# EAGLE design AKS (EAGLE 7.7.0)
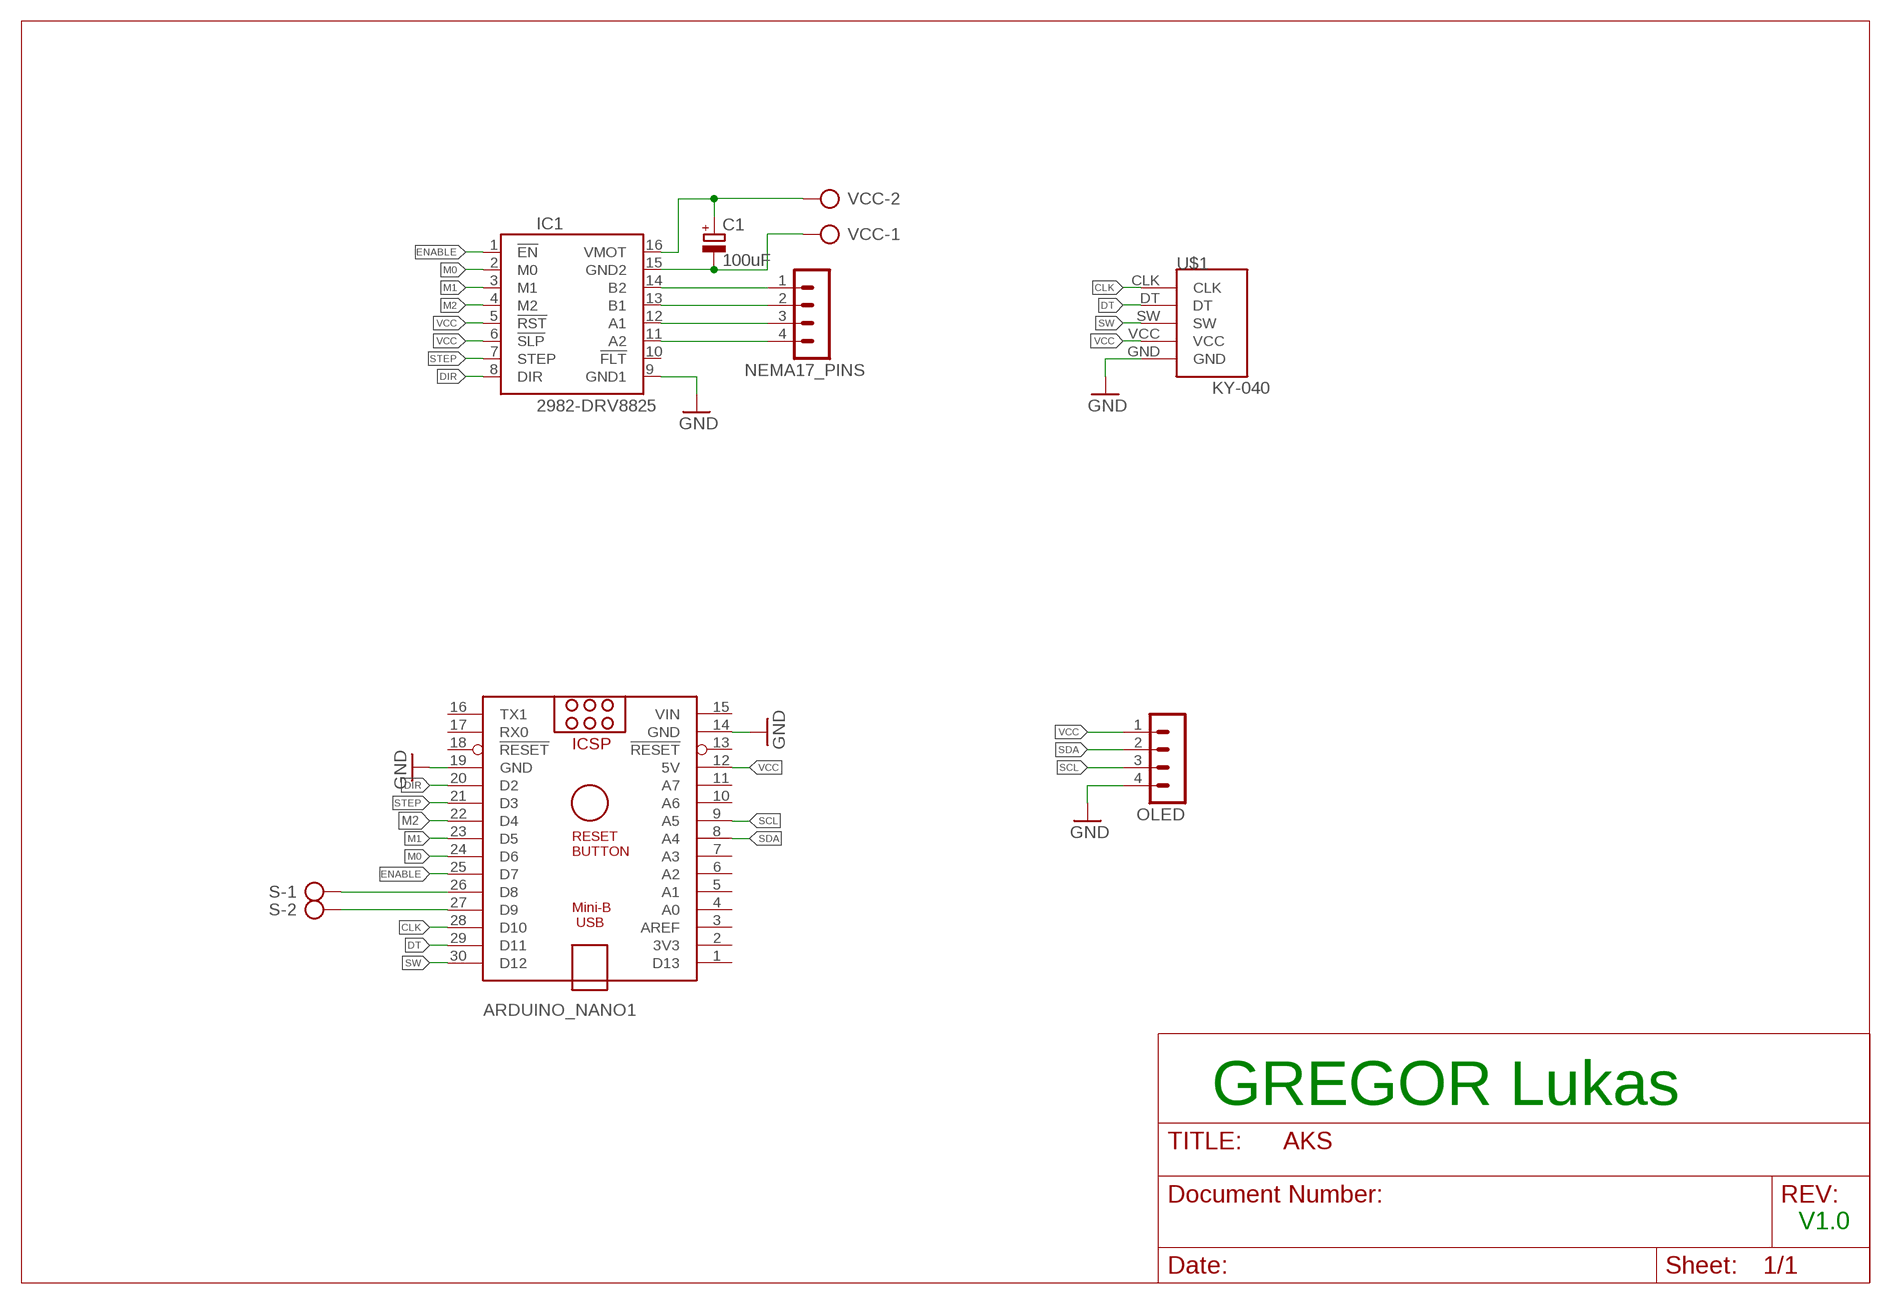
[diagram p0: schematic, sheet 1]

## Parts
ARDUINO_NANO1  ARDUINO_NANO  [ARDUINO_NANO]
C1  100uF  CPOL-EUE5-10.5  [E5-10,5]
IC1  2982-DRV8825  [DRV8825]
NEMA17_PINS  MA04-1  [MA04-1]
OLED  MA04-1  [MA04-1]
S  AK500/2  [AK500/2]
U$1  KY-040  [KY-040-PORT]
VCC  AK500/2  [AK500/2]

## Nets
+40V: C1.+ IC1.16(VMOT) VCC.2
CLK: ARDUINO_NANO1.28(D10) U$1.CLK
DIR: ARDUINO_NANO1.20(D2) IC1.8(DIR)
DT: ARDUINO_NANO1.29(D11) U$1.DT
ENABLE: ARDUINO_NANO1.25(D7) IC1.1(!EN)
GND: ARDUINO_NANO1.14(GND) ARDUINO_NANO1.19(GND) IC1.9(GND1) OLED.4 U$1.GND
GND2: C1.- IC1.15(GND2) VCC.1
M0: ARDUINO_NANO1.24(D6) IC1.2(M0)
M1: ARDUINO_NANO1.23(D5) IC1.3(M1)
M2: ARDUINO_NANO1.22(D4) IC1.4(M2)
N$1: IC1.14(B2) NEMA17_PINS.1
N$2: IC1.13(B1) NEMA17_PINS.2
N$3: IC1.12(A1) NEMA17_PINS.3
N$11: IC1.11(A2) NEMA17_PINS.4
S1: ARDUINO_NANO1.26(D8) S.1
S2: ARDUINO_NANO1.27(D9) S.2
SCL: ARDUINO_NANO1.9(A5) OLED.3
SDA: ARDUINO_NANO1.8(A4) OLED.2
STEP: ARDUINO_NANO1.21(D3) IC1.7(STEP)
SW: ARDUINO_NANO1.30(D12) U$1.SW
VCC: ARDUINO_NANO1.12(5V) IC1.5(!RST) IC1.6(!SLP) OLED.1 U$1.VCC
Unconnected: ARDUINO_NANO1.1(D13) ARDUINO_NANO1.2(3V3) ARDUINO_NANO1.3(AREF) ARDUINO_NANO1.4(A0) ARDUINO_NANO1.5(A1) ARDUINO_NANO1.6(A2) ARDUINO_NANO1.7(A3) ARDUINO_NANO1.10(A6) ARDUINO_NANO1.11(A7) ARDUINO_NANO1.13(!RESET) ARDUINO_NANO1.16(TX1) ARDUINO_NANO1.17(RX0) ARDUINO_NANO1.18(!RESET) IC1.10(!FLT)

## Notes on the sheet
- GREGOR Lukas
- V1.0

## Power pins joined to a net without a drawn wire
VIN: ARDUINO_NANO1.15(VIN)

## Library data of the parts
ARDUINO_NANO1 = ArduinoNanoV30:ARDUINO_NANO: Arduino Nano V3.0 Overview: The Arduino Nano is a small, complete, and breadboard-friendly board based on the ATmega328 (Arduino Nano 3.x) or ATmega168 (Arduino Nano 2.x). It has more or less the same functionality of the Arduino Duemilanove, but in a different package. It lacks only a DC power jack, and works with a Mini-B USB cable instead of a standard one. The Nano was designed and is being produced by Gravitech. Specifications: Microcontroller Atmel ATmega168 or ATmega328 Operating Voltage (logic level) 5 V Input Voltage (recommended) 7-12 V Input Voltage (limits) 6-20 V Digital I/O Pins 14 (of which 6 provide PWM output) Analog Input Pins 8 DC Current per I/O Pin 40 mA Flash Memory 16 KB (ATmega168) or 32 KB (ATmega328) of which 2 KB used by bootloader SRAM 1 KB (ATmega168) or 2 KB (ATmega328) EEPROM 512 bytes (ATmega168) or 1 KB (ATmega328) Clock Speed 16 MHz Dimensions 0.73" x 1.70" Length 45 mm Width 18 mm Weigth 5 g Power: The Arduino Nano can be powered via the Mini-B USB connection, 6-20V unregulated external power supply (pin 30), or 5V regulated external power supply (pin 27). The power source is automatically selected to the highest voltage source. Memory: The ATmega168 has 16 KB of flash memory for storing code (of which 2 KB is used for the bootloader); the ATmega328 has 32 KB, (also with 2 KB used for the bootloader). The ATmega168 has 1 KB of SRAM and 512 bytes of EEPROM (which can be read and written with the EEPROM library); the ATmega328 has 2 KB of SRAM and 1 KB of EEPROM. Input and Output: Each of the 14 digital pins on the Nano can be used as an input or output, using pinMode(), digitalWrite(), and digitalRead() functions. They operate at 5 volts. Each pin can provide or receive a maximum of 40 mA and has an internal pull-up resistor (disconnected by default) of 20-50 kOhms. In addition, some pins have specialized functions. Visit Arduino - ArduinoBoardNano <https://www.arduino.cc/en/Main/ArduinoBoardNano>
C1 = rcl:CPOL-EU: POLARIZED CAPACITOR, European symbol; SPICEPREFIX: C
IC1 = pololu-stepper-driver:2982-DRV8825: DRV8825 Stepper Motor Driver Carrier; High Current (Header Pins Soldered) #2982 DRV8825 Stepper Motor Driver Carrier; High Current (Header Pins Soldered) <https://www.pololu.com/product/2982> in Japan, Suzaku Lab. Ltd. <https://suzakugiken.jp/> #2982 DRV8825 大電流用ステッピングモータドライバ (ピンヘッダ実装済み) <https://szc.jp/po2982>
NEMA17_PINS OLED = con-lstb:MA04-1: PIN HEADER; OC_FARNELL: unknown; OC_NEWARK: unknown
S VCC = con-ptr500:AK500/2: CONNECTOR; OC_FARNELL: unknown; OC_NEWARK: unknown
U$1 = KY-040:KY-040: Check availability <https://pricing.snapeda.com/parts/KY-040/Joy-IT/view-part?ref=eda>; AVAILABILITY: Not in stock; CHECK_PRICES: https://www.snapeda.com/parts/KY-040/Joy-IT/view-part/?ref=eda; DESCRIPTION: KY-5.0-4P Green(RAL6018/T) ; CONTACT WITH TIN PLATED MARK; MF: Joy-IT; MP: KY-040; PACKAGE: Package; PRICE: None; SNAPEDA_LINK: https://www.snapeda.com/parts/KY-040/Joy-IT/view-part/?ref=snap

## Board
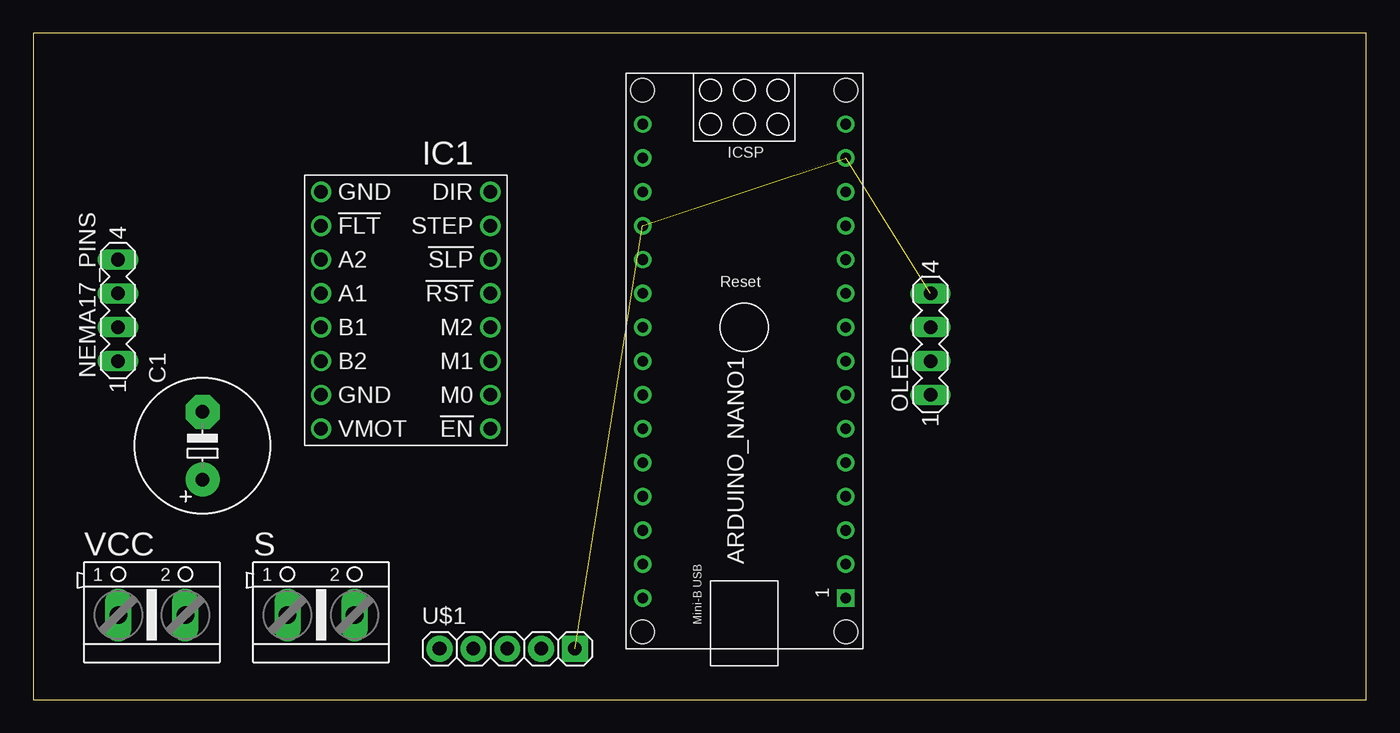
[diagram p1: board, top side]
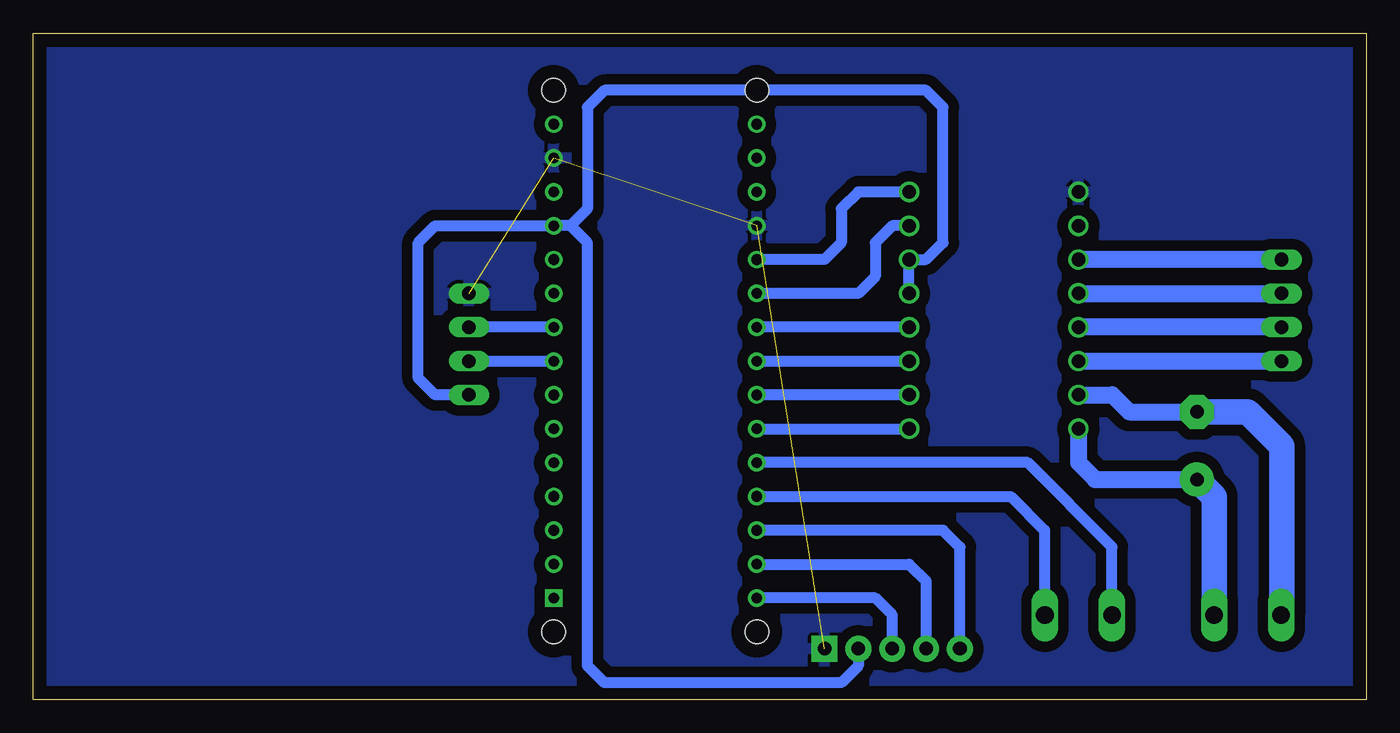
[diagram p2: board, bottom side, seen from below]

Size 100 x 50 mm. Coordinates in mm from the lower left corner, seen from the top.
Outline: 0,0 100,0 100,50 0,50 0,0
Copper layers (1*16): Top 0.035mm / dielectric 1.5mm / Bottom 0.035mm
Design rules "default": minimum track width 10mil, minimum drill 24mil, track to track 8mil, track to pad 8mil, pad to pad 8mil, via to via 8mil, smd to smd 8mil, copper to edge 40mil, drill to drill 8mil, minimum pad ring 10mil, minimum via ring 8mil, stop-mask expansion 4mil, vias tented up to drill 0mil, thermal gap 10mil

### Footprints (pad centres in the part's own frame; a part is rotated, then mirrored left to right if it is on the bottom)
ARDUINO_NANO = drill 0.8 square: 1 -20.32,-7.62 | drill 0.8: 2 -17.78,-7.62; 3 -15.24,-7.62; 4 -12.7,-7.62; 5 -10.16,-7.62; 6 -7.62,-7.62; 7 -5.08,-7.62; 8 -2.54,-7.62; 9 0,-7.62; 10 2.54,-7.62; 11 5.08,-7.62; 12 7.62,-7.62; 13 10.16,-7.62; 14 12.7,-7.62; 15 15.24,-7.62; 16 15.24,7.62; 17 12.7,7.62; 18 10.16,7.62; 19 7.62,7.62; 20 5.08,7.62; 21 2.54,7.62; 22 0,7.62; 23 -2.54,7.62; 24 -5.08,7.62; 25 -7.62,7.62; 26 -10.16,7.62; 27 -12.7,7.62; 28 -15.24,7.62; 29 -17.78,7.62; 30 -20.32,7.62 | hole 1.778: -22.86,-7.62; -22.86,7.62; 17.78,7.62; 17.78,-7.62
E5-10,5 = drill 1.016 pad 2.54: + -2.54,0 | drill 1.016 pad 2.54 octagon: - 2.54,0
DRV8825 = drill 1.016: 1 -6.35,8.89; 2 -6.35,6.35; 3 -6.35,3.81; 4 -6.35,1.27; 5 -6.35,-1.27; 6 -6.35,-3.81; 7 -6.35,-6.35; 8 -6.35,-8.89; 9 6.35,-8.89; 10 6.35,-6.35; 11 6.35,-3.81; 12 6.35,-1.27; 13 6.35,1.27; 14 6.35,3.81; 15 6.35,6.35; 16 6.35,8.89
MA04-1 = drill 1.016 long: 1 -3.81,0; 2 -1.27,0; 3 1.27,0; 4 3.81,0
AK500/2 = drill 1.321 long: 1 -2.515,0; 2 2.515,0
KY-040-PORT = drill 1.016 pad 1.93: CLK -6.35,0; DT -3.81,0; SW -1.27,0; VCC 1.27,0 | drill 1.016 pad 1.93 square: GND 3.81,0

### Placement (x,y rotation side)
ARDUINO_NANO1  53.34,27.94 90 top
C1  12.7,19.05 90 top
IC1  27.94,29.21 180 top
NEMA17_PINS  6.35,29.21 90 top
OLED  67.31,26.67 90 top
S  21.59,6.35 0 top
U$1  36.83,3.81 0 top
VCC  8.89,6.35 0 top

### Tracks (layer width: path | path; a pad name or v marks a point on that pad's centre or on a via)
+40V
  Bottom 1.27: IC1.16 21.59,17.78 20.32,16.51 C1.+
  Bottom 1.93: VCC.2 11.4,15.21 C1.+
CLK
  Bottom 0.813: U$1.CLK 30.48,11.43 31.75,12.7 ARDUINO_NANO1.28
DIR
  Bottom 0.813: IC1.8 38.1,38.1 39.37,36.83 39.37,34.29 40.64,33.02 ARDUINO_NANO1.20
DT
  Bottom 0.813: ARDUINO_NANO1.29 34.29,10.16 33.02,8.89 U$1.DT
ENABLE
  Bottom 0.813: ARDUINO_NANO1.25 IC1.1
GND  (3 unrouted)
  pour Bottom (isolate 0.8): 0,50 100,50 100,0 0,0
GND2
  Bottom 1.27: IC1.15 19.05,22.86 17.78,21.59 C1.-
  Bottom 1.93: C1.- 8.89,21.59 6.35,19.05 6.35,6.38 VCC.1
M0
  Bottom 0.813: IC1.2 ARDUINO_NANO1.24
M1
  Bottom 0.813: ARDUINO_NANO1.23 IC1.3
M2
  Bottom 0.813: IC1.4 ARDUINO_NANO1.22
N$1
  Bottom 1.27: IC1.14 NEMA17_PINS.1
N$2
  Bottom 1.27: NEMA17_PINS.2 IC1.13
N$3
  Bottom 1.27: IC1.12 NEMA17_PINS.3
N$11
  Bottom 1.27: NEMA17_PINS.4 IC1.11
S1
  Bottom 0.813: S.1 19.07,11.46 25.4,17.78 ARDUINO_NANO1.26
S2
  Bottom 0.813: ARDUINO_NANO1.27 26.67,15.24 24.13,12.7 24.13,6.38 S.2
SCL
  Bottom 0.813: ARDUINO_NANO1.9 OLED.3
SDA
  Bottom 0.813: OLED.2 ARDUINO_NANO1.8
STEP
  Bottom 0.813: IC1.7 35.56,35.56 36.83,34.29 36.83,31.75 38.1,30.48 ARDUINO_NANO1.21
SW
  Bottom 0.813: U$1.SW 35.56,6.35 36.83,7.62 ARDUINO_NANO1.30
VCC
  Bottom 0.813: OLED.1 69.85,22.86 71.12,24.13 71.12,34.29 69.85,35.56 ARDUINO_NANO1.12 59.69,35.56 | IC1.5 IC1.6 33.02,33.02 31.75,34.29 31.75,44.45 33.02,45.72 57.15,45.72 58.42,44.45 58.42,36.83 59.69,35.56 | U$1.VCC 38.1,2.54 39.37,1.27 57.15,1.27 58.42,2.54 58.42,34.29 59.69,35.56